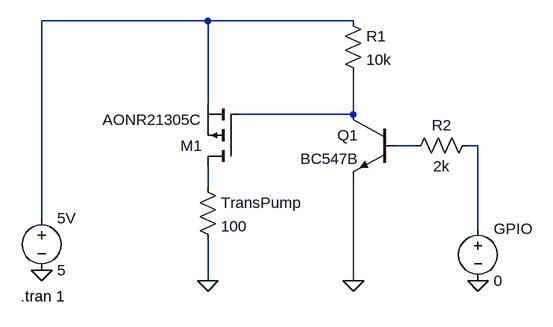
[diagram p0: schematic TransPump.asc]
TransPump.asc, the LTspice schematic file:
Version 4
SHEET 1 900 680
WIRE 240 -160 -16 -160
WIRE 464 -160 240 -160
WIRE 240 -32 240 -160
WIRE 464 -16 464 -80
WIRE 464 -16 288 -16
WIRE 560 32 528 32
WIRE 656 32 640 32
WIRE 240 96 240 64
WIRE -16 144 -16 -160
WIRE 656 160 656 32
WIRE 240 240 240 176
WIRE 464 240 464 80
FLAG 240 240 0
FLAG -16 224 0
FLAG 656 240 0
FLAG 464 240 0
SYMBOL voltage -16 128 R0
WINDOW 123 0 0 Left 0
WINDOW 39 0 0 Left 0
SYMATTR InstName 5V
SYMATTR Value 5
SYMBOL voltage 656 144 R0
SYMATTR InstName GPIO
SYMATTR Value 0
SYMBOL res 224 80 R0
SYMATTR InstName TransPump
SYMATTR Value 100
SYMBOL pmos 288 64 R180
SYMATTR InstName M1
SYMATTR Value AONR21305C
SYMBOL npn 528 -16 M0
SYMATTR InstName Q1
SYMATTR Value BC547B
SYMBOL res 448 -176 R0
SYMATTR InstName R1
SYMATTR Value 10k
SYMBOL res 656 16 R90
WINDOW 0 0 56 VBottom 2
WINDOW 3 32 56 VTop 2
SYMATTR InstName R2
SYMATTR Value 2k
TEXT -48 264 Left 2 !.tran 1

The netlist it stands for:
* TransPump.asc
V§5V N001 0 5
V§GPIO N004 0 0
R§TransPump N005 0 100
M1 N005 N002 N001 N001 AONR21305C
Q1 N002 N003 0 0 BC547B
R1 N001 N002 10k
R2 N004 N003 2k
.model NPN NPN
.model PNP PNP
.lib standard.bjt
.model NMOS NMOS
.model PMOS PMOS
.lib standard.mos
.tran 1
.backanno
.end